# Altium schematic sheet STeaMi-FP11-Port_JTAG.SchDoc
size A3; DocumentNumber: 1; SheetNumber: 12; SheetTotal: 16
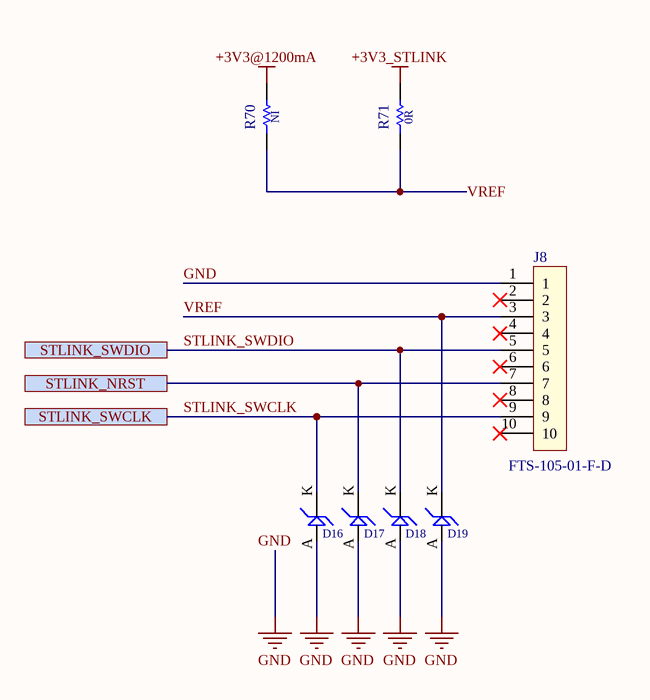
[diagram p0: STeaMi-FP11-Port_JTAG.SchDoc]

## Parts
D16  (no value)  [SODFL1608X70N]
D17  (no value)  [SODFL1608X70N]
D18  (no value)  [SODFL1608X70N]
D19  (no value)  [SODFL1608X70N]
J8  (no value)  [FTS-105-01-F-D]
R70  (no value)  [RESC1005X40N_0402]
R71  Resistance: 0R  [RESC1005X40N_0402]

## Ports
STLINK_NRST, STLINK_SWCLK, STLINK_SWDIO

## Nets
+3V3@1200mA: R70.2
+3V3_STLINK: R71.2
GND: D16.A D17.A D18.A D19.A J8.1
STLINK_NRST: D17.K J8.7 ; port STLINK_NRST
STLINK_SWCLK: D16.K J8.9 ; port STLINK_SWCLK
STLINK_SWDIO: D18.K J8.5 ; port STLINK_SWDIO
VREF: D19.K J8.3 R70.1 R71.1

Not connected (* = marked no-connect by the designer): J8 2* 4* 6* 8* 10*

## Notes on the sheet
- Le présent document est la propriété exclusive de SmartEmbed. Remis à titre confidentiel, il ne peut être communiqué
- IND
- DATE
- DESCRIPTION
- VISA
- à des tiers, ni utilisé ou reproduit qu'en stricte conformité d'autorisations expresses préalables.
- Etabli le:
- Verifié le:
- Validé le:
- Par:
- Page:
- /
- Pépinière CleanTech Domaine du Petit Arbois Avenue Louis Philibert BP 80058 13792 AIX-EN-PROVENCE CEDEX 3
- REFERENCE
- DESIGNATION

## Library data of the parts
D16-D19 = ESD8351XV2T1G: Suppresseurs ESD / diodes TVS LOW CAP SNAPBACK ESD PROT; Manufacturer: OnSemiconductor; Populated: True; Voltage: 3V3; Switch possibility: False; Vérification: Non; Created by: EAG; Creation Date: 18/12/2021; Manufacturer Part Number: ESD8351XV2T1G; Part Number: ESD8351XV2T1G; Farnell: 2770609; Mouser: 863-ESD8351XV2T1G
J8 = FTS-105-01-F-D: Embase FTS 10 point 1,27 mm vertical; Manufacturer: SAMTEC; Populated: False; Switch possibility: False; Vérification: Non; Checked by: *; Creation Date: 25/09/2019; Created by: EAG; Manufacturer Part Number: FTS-105-01-F-D; Part Number: FTS-105-01-F-D; Digikey: SAM9420-ND; Mouser: 200-FTS10501FD
R70 = NI-1%-0,1W-0603: NI; Populated: True; Power: 0,1; Nom vérificateur: Non; std Package: 0603; Tolerence: 0,01; Created by: MSA; Creation Date: 20/03/2019; Manufacturer: -; Manufacturer Part Number: -; Resistance: NI; Part Number: NI-1%-0,1W-0603; Digikey: -; Farnell: -; Mouser: -; RS: -; Switch possibility: True
R71 = 0R-5%-0,0625W-0402: RES CMS 0R5%-0,0625W-0402; Manufacturer: Yageo; Manufacturer Part Number: RC0402JR-100RL; Populated: True; Power: 0,0625; Nom vérificateur: Non; Prix: 0,09; std Package: 0402; Tolerence: 0,05; Created by: EAG; Creation Date: 02/12/2021; Part Number: 0R-5%-0,0625W-0402; Mouser: 603-RC0402JR-100RL; Switch possibility: True